# Altium schematic sheet myjtag.SchDoc
size A4
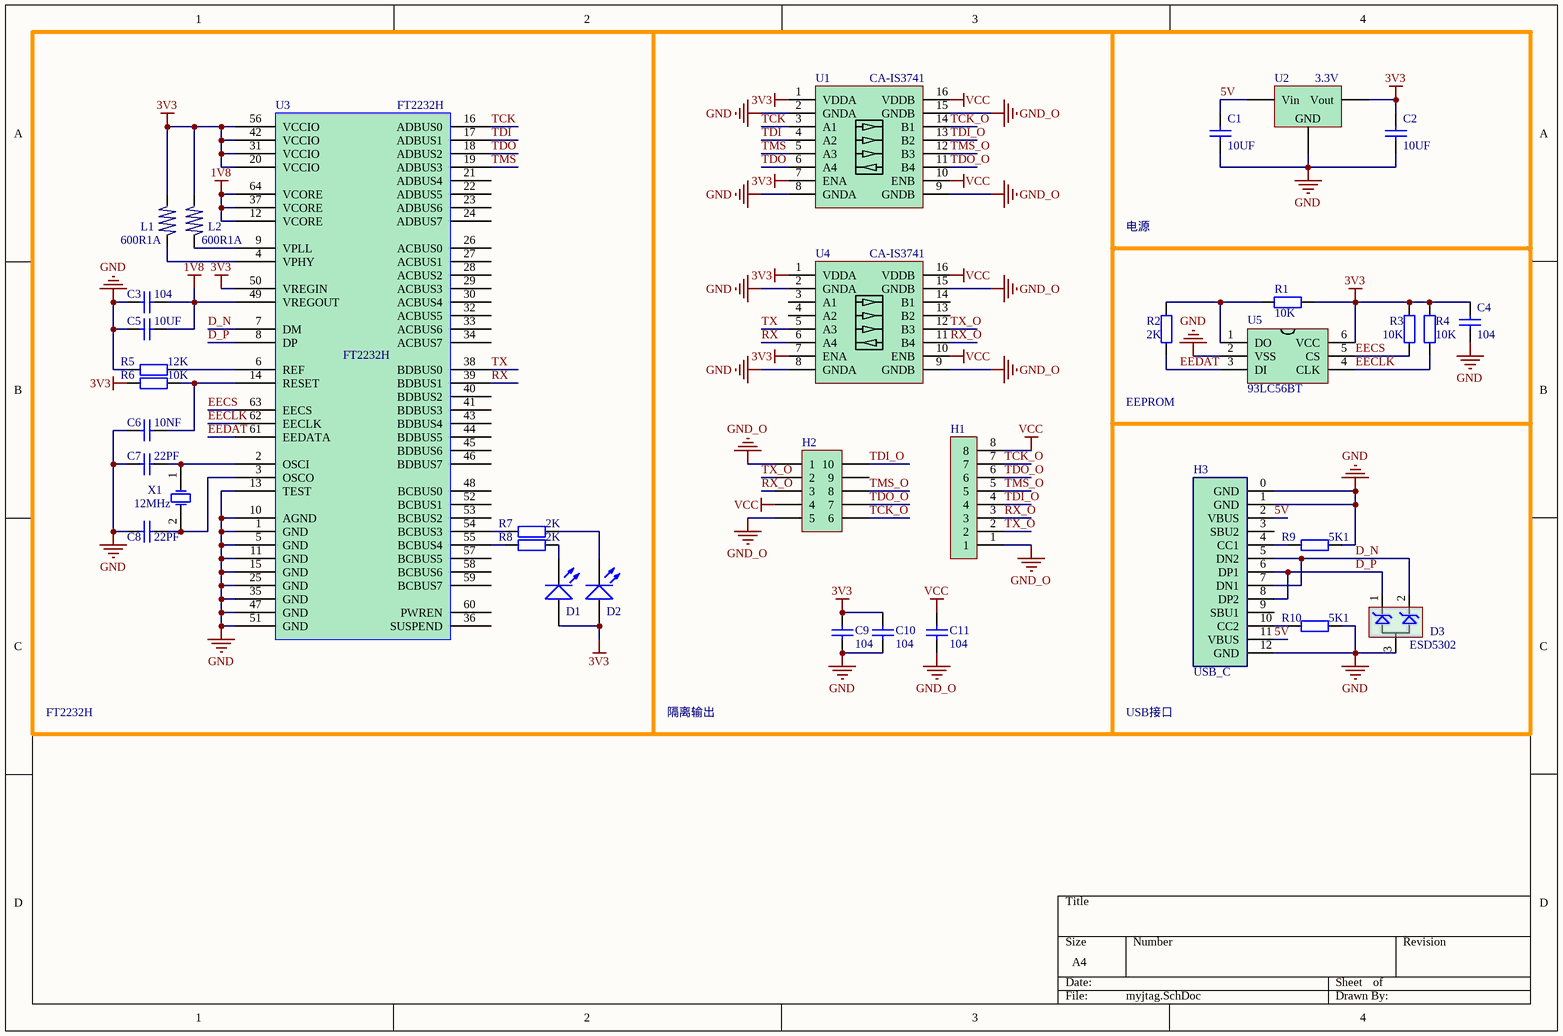
[diagram p0: myjtag.SchDoc]

## Parts
C1  10UF  [0603_C]
C2  10UF  [0603_C]
C3  104  [0603_C]
C4  104  [0603_C]
C5  10UF  [0603_C]
C6  10NF  [0603_C]
C7  22PF  [0603_C]
C8  22PF  [0603_C]
C9  104  [0603_C]
C10  104  [0603_C]
C11  104  [0603_C]
D1  0603_LED  [0603_LED]  (value not drawn)
D2  0603_LED  [0603_LED]  (value not drawn)
D3  ESD5302  [SOT23]
H1  SH1.25mm_8P  [SH1.25MM_8P]  (value not drawn)
H2  Header_2.54_5P_2  [HDR2_5P]  (value not drawn)
H3  USB_C  [USB_C_16PIN_SMT]
L1  600R1A  [0603_R]
L2  600R1A  [0603_R]
R1  10K  [0603_R]
R2  2K  [0603_R]
R3  10K  [0603_R]
R4  10K  [0603_R]
R5  12K  [0603_R]
R6  10K  [0603_R]
R7  2K  [0603_R]
R8  2K  [0603_R]
R9  5K1  [0603_R]
R10  5K1  [0603_R]
U1  CA-IS3741  [SOIC16N]
U2  3.3V  [SOT23]
U3  FT2232H  [LQFP64]
U4  CA-IS3741  [SOIC16N]
U5  93LC56BT  [SOT_23_6]
X1  12MHz  [XTAL_5032]

## Nets
1V8: C3.2 C5.2 U3.12(VCORE) U3.37(VCORE) U3.49(VREGOUT) U3.64(VCORE)
3V3: C2.2 C4.1 C9.2 C10.2 D1.A D2.A L1.2 L2.2 R1.1 R3.1 R4.1 R6.2 U1.1(VDDA) U1.7(ENA) U2.2(Vout) U3.20(VCCIO) U3.31(VCCIO) U3.42(VCCIO) U3.50(VREGIN) U3.56(VCCIO) U4.1(VDDA) U4.7(ENA) U5.6(VCC)
GND: C1.1 C2.1 C3.1 C4.2 C5.1 C6.1 C7.1 C8.1 C9.1 C10.1 D3.3 H3.0(GND) H3.1(GND) H3.12(GND) R5.2 R9.1 R10.1 U1.2(GNDA) U1.8(GNDA) U2.1(GND) U3.1(GND) U3.5(GND) U3.10(AGND) U3.11(GND) U3.13(TEST) U3.15(GND) U3.25(GND) U3.35(GND) U3.47(GND) U3.51(GND) U4.2(GNDA) U4.8(GNDA) U5.2(VSS)
GND_O: C11.1 H1.1 H2.1 H2.5 U1.9(GNDB) U1.15(GNDB) U4.9(GNDB) U4.15(GNDB)
VCC: C11.2 H1.8 H2.4 U1.10(ENB) U1.16(VDDB) U4.10(ENB) U4.16(VDDB)
5V: C1.2 H3.2(VBUS) H3.11(VBUS) U2.3(Vin)
D_N: D3.2 H3.5(DN2) H3.7(DN1) U3.7(DM)
D_P: D3.1 H3.6(DP1) H3.8(DP2) U3.8(DP)
EECLK: R4.2 U3.62(EECLK) U5.4(CLK)
EECS: R3.2 U3.63(EECS) U5.5(CS)
EEDAT: R2.2 U3.61(EEDATA) U5.3(DI)
RX: U3.39(BDBUS1) U4.6(A4)
RX_O: H1.3 H2.3 U4.11(B4)
TCK: U1.3(A1) U3.16(ADBUS0)
TCK_O: H1.7 H2.6 U1.14(B1)
TDI: U1.4(A2) U3.17(ADBUS1)
TDI_O: H1.4 H2.10 U1.13(B2)
TDO: U1.6(A4) U3.18(ADBUS2)
TDO_O: H1.6 H2.7 U1.11(B4)
TMS: U1.5(A3) U3.19(ADBUS3)
TMS_O: H1.5 H2.8 U1.12(B3)
TX: U3.38(BDBUS0) U4.5(A3)
TX_O: H1.2 H2.2 U4.12(B3)
NetC6_2: C6.2 R6.1 U3.14(RESET)
NetC7_2: C7.2 U3.2(OSCI) X1.1(OSC1)
NetC8_2: C8.2 U3.3(OSCO) X1.2(OSC2)
NetD1_K: D1.K R8.1
NetD2_K: D2.K R7.1
NetH3_4: H3.4(CC1) R9.2
NetH3_10: H3.10(CC2) R10.2
NetL1_1: L1.1 U3.4(VPHY)
NetL2_1: L2.1 U3.9(VPLL)
NetR1_2: R1.2 R2.1 U5.1(DO)
NetR5_1: R5.1 U3.6(REF)
NetR7_2: R7.2 U3.54(BCBUS3)
NetR8_2: R8.2 U3.55(BCBUS4)

Not connected (* = marked no-connect by the designer): H2 9; H3 3(SBU2) 9(SBU1); U3 21(ADBUS4) 22(ADBUS5) 23(ADBUS6) 24(ADBUS7) 26(ACBUS0) 27(ACBUS1) 28(ACBUS2) 29(ACBUS3) 30(ACBUS4) 32(ACBUS5) 33(ACBUS6) 34(ACBUS7) 36(SUSPEND) 40(BDBUS2) 41(BDBUS3) 43(BDBUS4) 44(BDBUS5) 45(BDBUS6) 46(BDBUS7) 48(BCBUS0) 52(BCBUS1) 53(BCBUS2) 57(BCBUS5) 58(BCBUS6) 59(BCBUS7) 60(PWREN); U4 3(A1) 4(A2) 13(B2) 14(B1)

## Notes on the sheet
- 电源
- EEPROM
- FT2232H
- 隔离输出
- USB接口

## Library data of the parts
C1-C11 = 0603_CAP
D3 = PESD5V2S2UT: ESD DIODE
H3 = USB_C_16P_SMT
L1 L2 = 0603_BeadCore: Bead core
R1-R10 = 0603_RES
U2 = LDO_XC6206P332MR: 线性稳压器
X1 = XTAL_5032: 贴片无源晶振